# EAGLE design sd-card reader level shift (EAGLE 6.1)
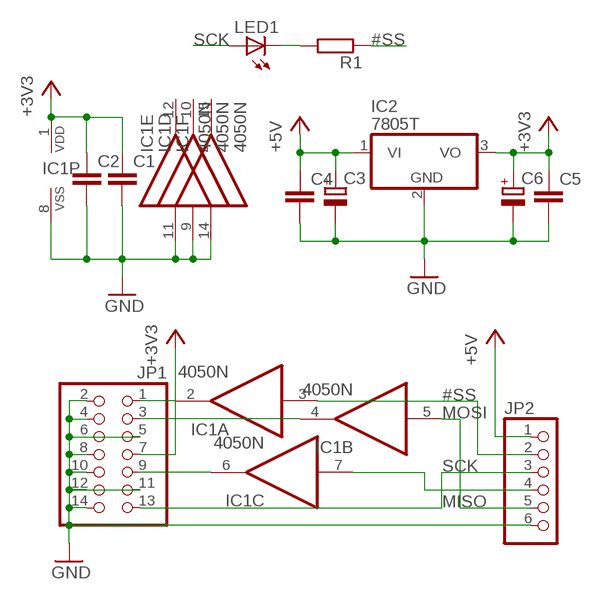
[diagram p0: schematic, sheet 1]

## Parts
C1  C-EU025-025X050  [C025-025X050]
C2  C-EU025-025X050  [C025-025X050]
C3  CPOL-EUE2.5-5  [E2,5-5]
C4  C-EU025-025X050  [C025-025X050]
C5  C-EU025-025X050  [C025-025X050]
C6  CPOL-EUE2.5-5  [E2,5-5]
IC1  4050N  [DIL16]
IC2  7805T  [TO220H]
JP1  PINHD-2X7/90  [2X07/90]
JP2  PINHD-1X6  [1X06]
LED1  LED3MM  [LED3MM]
R1  R-EU_0204/7  [0204/7]

## Nets
#SS: IC1.3(A:I) JP2.2 R1.1
+3V3: C1.1 C2.1 C5.1 C6.+ IC1.1(P:VDD) IC2.3(VO) JP1.7
+5V: C3.+ C4.1 IC2.1(VI) JP2.1
GND: C1.2 C2.2 C3.- C4.2 C5.2 C6.- IC1.8(P:VSS) IC1.9(D:I) IC1.11(E:I) IC1.14(F:I) IC2.2(GND) JP1.2 JP1.4 JP1.5 JP1.6 JP1.8 JP1.10 JP1.11 JP1.12 JP1.14 JP2.6
MISO: JP1.13 JP2.3
MOSI: IC1.5(B:I) JP2.5
N$2: IC1.2(A:O) JP1.1
N$3: IC1.4(B:O) JP1.3
N$4: IC1.6(C:O) JP1.9
N$6: LED1.K(C) R1.2
SCK: IC1.7(C:I) JP2.4 LED1.A
Unconnected: IC1.10(D:O) IC1.12(E:O) IC1.15(F:O)

## Library data of the parts
C1 C2 C4 C5 = rcl:C-EU: CAPACITOR, European symbol
C3 C6 = rcl:CPOL-EU: POLARIZED CAPACITOR, European symbol
IC1 = 40xx:4050: Hex non-inverting BUFFER
IC2 = adafruit:78*: Positive VOLTAGE REGULATOR Added bigger pads to the TO-92 package
JP1 = pinhead:PINHD-2X7: PIN HEADER
JP2 = pinhead:PINHD-1X6: PIN HEADER
LED1 = led:LED: LED OSRAM: - CHIPLED LG R971, LG N971, LY N971, LG Q971, LY Q971, LO R971, LY R971 LH N974, LH R974 LS Q976, LO Q976, LY Q976 LO Q996 - Hyper CHIPLED LW Q18S LB Q993, LB Q99A, LB R99A - SideLED LS A670, LO A670, LY A670, LG A670, LP A670 LB A673, LV A673, LT A673, LW A673 LH A674 LY A675 LS A676, LA A676, LO A676, LY A676, LW A676 LS A679, LY A679, LG A679 - Hyper Micro SIDELED® LS Y876, LA Y876, LO Y876, LY Y876 LT Y87S - SmartLED LW L88C, LW L88S LB L89C, LB L89S, LG L890 LS L89K, LO L89K, LY L89K LS L896, LA L896, LO L896, LY L896 - TOPLED LS T670, LO T670, LY T670, LG T670, LP T670 LSG T670, LSP T670, LSY T670, LOP T670, LYG T670 LG T671, LOG T671, LSG T671 LB T673, LV T673, LT T673, LW T673 LH T674 LS T676, LA T676, LO T676, LY T676, LB T676, LH T676, LSB T676, LW T676 LB T67C, LV T67C, LT T67C, LS T67K, LO T67K, LY T67K, LW E67C LS E67B, LA E67B, LO E67B, LY E67B, LB E67C, LV E67C, LT E67C LW T67C LS T679, LY T679, LG T679 LS T770, LO T770, LY T770, LG T770, LP T770 LB T773, LV T773, LT T773, LW T773 LH T774 LS E675, LA E675, LY E675, LS T675 LS T776, LA T776, LO T776, LY T776, LB T776 LHGB T686 LT T68C, LB T68C - Hyper Mini TOPLED® LB M676 - Mini TOPLED Santana® LG M470 LS M47K, LO M47K, LY M47K Source: http://www.osram.convergy.de LUXEON: - LUMILED® LXK2-PW12-R00, LXK2-PW12-S00, LXK2-PW14-U00, LXK2-PW14-V00 LXK2-PM12-R00, LXK2-PM12-S00, LXK2-PM14-U00 LXK2-PE12-Q00, LXK2-PE12-R00, LXK2-PE12-S00, LXK2-PE14-T00, LXK2-PE14-U00 LXK2-PB12-K00, LXK2-PB12-L00, LXK2-PB12-M00, LXK2-PB14-N00, LXK2-PB14-P00, LXK2-PB14-Q00 LXK2-PR12-L00, LXK2-PR12-M00, LXK2-PR14-Q00, LXK2-PR14-R00 LXK2-PD12-Q00, LXK2-PD12-R00, LXK2-PD12-S00 LXK2-PH12-R00, LXK2-PH12-S00 LXK2-PL12-P00, LXK2-PL12-Q00, LXK2-PL12-R00 Source: www.luxeon.com KINGBRIGHT: KA-3528ASYC Source: www.kingbright.com
R1 = rcl:R-EU_: RESISTOR, European symbol

## Board
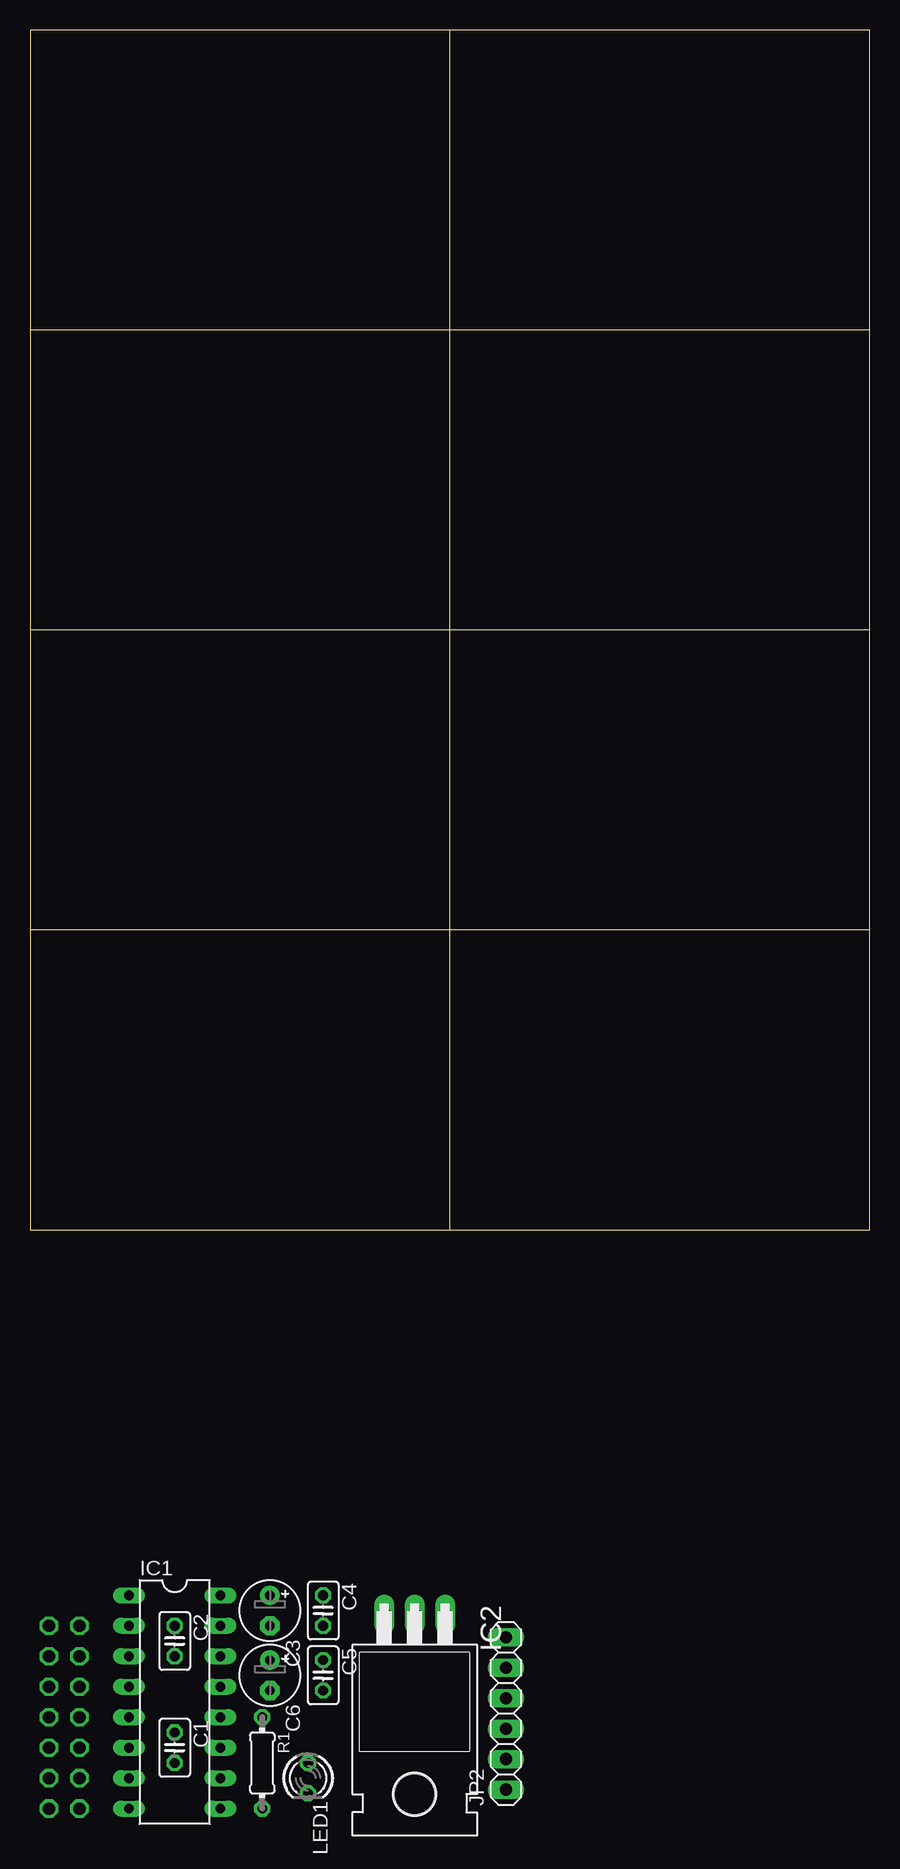
[diagram p1: board, top side]
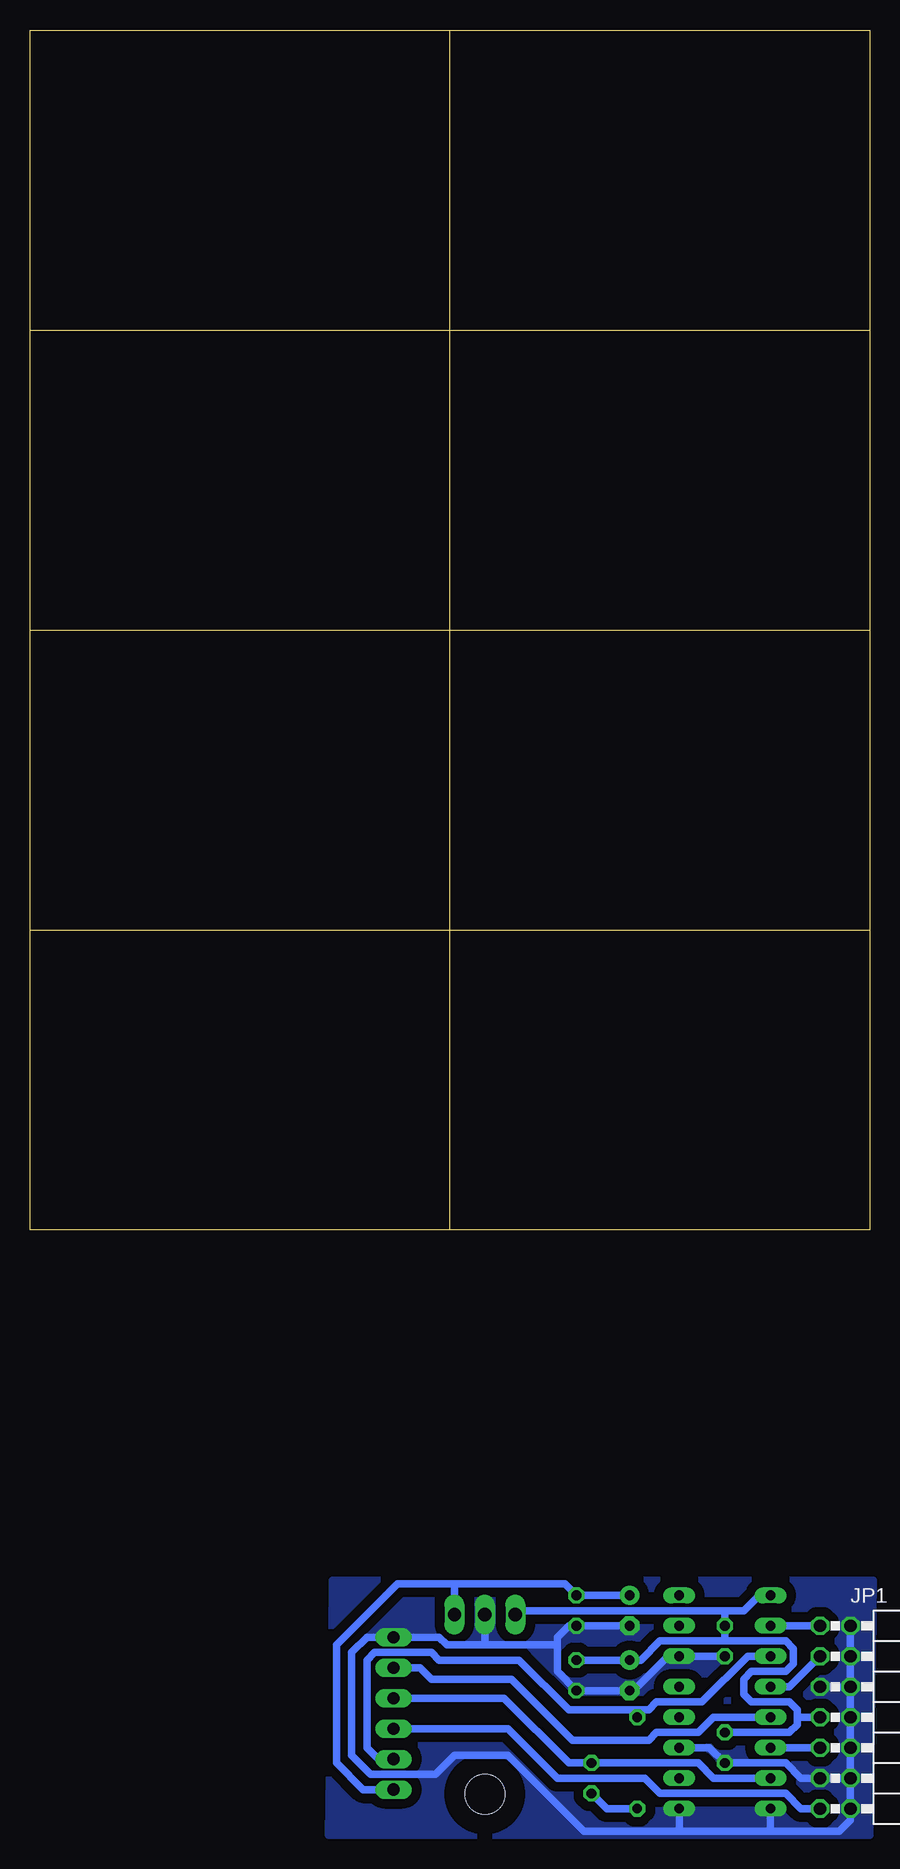
[diagram p2: board, bottom side, seen from below]

Size 70 x 100 mm. Coordinates in mm from the lower left corner, seen from the top.
Outline: 35,0 0,0 0,25
Outline: 35,0 70,0 70,25
Outline: 70,25 70,50
Outline: 70,50 70,75
Outline: 70,75 70,100 35,100
Outline: 35,100 0,100 0,75
Outline: 0,75 0,50
Outline: 0,50 0,25
Outline: 70,25 0,25
Outline: 35,0 35,100
Outline: 70,75 0,75
Outline: 70,50 0,50
Copper layers (1*16): Top 0.035mm / dielectric 1.5mm / Bottom 0.035mm
Design rules: minimum track width 10mil, minimum drill 24mil, track to track 8mil, track to pad 8mil, pad to pad 8mil, via to via 8mil, smd to smd 8mil, copper to edge 40mil, drill to drill 8mil, minimum pad ring 10mil, minimum via ring 8mil, stop-mask expansion 4mil, vias tented up to drill 0mil, thermal gap 10mil

### Footprints (pad centres in the part's own frame; a part is rotated, then mirrored left to right if it is on the bottom)
C025-025X050 = drill 0.813 octagon: 1 -1.27,0; 2 1.27,0
E2,5-5 = drill 0.813 pad 1.6: + -1.27,0 | drill 0.813 pad 1.6 octagon: - 1.27,0
DIL16 = drill 0.813 long: 1 -8.89,-3.81; 2 -6.35,-3.81; 3 -3.81,-3.81; 4 -1.27,-3.81; 5 1.27,-3.81; 6 3.81,-3.81; 7 6.35,-3.81; 8 8.89,-3.81; 9 8.89,3.81; 10 6.35,3.81; 11 3.81,3.81; 12 1.27,3.81; 13 -1.27,3.81; 14 -3.81,3.81; 15 -6.35,3.81; 16 -8.89,3.81
TO220H = drill 1.118 long: 1 -2.54,-10.16; 2 0,-10.16; 3 2.54,-10.16 | hole 3.302: 0,4.826
2X07/90 = drill 1.016 octagon: 1 -7.62,-6.35; 2 -7.62,-3.81; 3 -5.08,-6.35; 4 -5.08,-3.81; 5 -2.54,-6.35; 6 -2.54,-3.81; 7 0,-6.35; 8 0,-3.81; 9 2.54,-6.35; 10 2.54,-3.81; 11 5.08,-6.35; 12 5.08,-3.81; 13 7.62,-6.35; 14 7.62,-3.81
1X06 = drill 1.016 long: 1 -6.35,0; 2 -3.81,0; 3 -1.27,0; 4 1.27,0; 5 3.81,0; 6 6.35,0
LED3MM = drill 0.813 octagon: A -1.27,0; K 1.27,0
0204/7 = drill 0.813 octagon: 1 -3.81,0; 2 3.81,0

### Placement (x,y rotation side)
C1  12.06,-43.18 270 top  (outside the outline)
C2  12.06,-34.29 270 top  (outside the outline)
C3  20,-31.75 270 top  (outside the outline)
C4  24.45,-31.75 270 top  (outside the outline)
C5  24.45,-37.15 270 top  (outside the outline)
C6  20,-37.15 270 top  (outside the outline)
IC1  12.06,-39.37 270 top  (outside the outline)
IC2  32.07,-42.23 180 top  (outside the outline)
JP1  -2.22,-40.64 270 bottom  (outside the outline)
JP2  39.69,-40.32 90 top  (outside the outline)
LED1  23.18,-45.72 270 top  (outside the outline)
R1  19.37,-44.45 270 top  (outside the outline)

### Tracks (layer width: path | path; a pad name or v marks a point on that pad's centre or on a via)
#SS
  Bottom 0.61: IC1.3 10.16,-35.56 13.97,-39.37 17.78,-39.37 18.41,-40.01 19.37,-40.01 | 19.37,-40.01 25.08,-40.01 29.21,-35.88 35.88,-35.88 36.51,-35.24 41.27,-35.24 41.91,-35.88 41.91,-43.18 40.96,-44.13 JP2.2 | R1.1 19.37,-40.01
+3V3
  Bottom 0.61: 12.06,-31.75 10.48,-31.75 9.21,-30.48 IC1.1 | 12.06,-31.75 29.21,-31.75 IC2.3 | C5.1 C6.+ 19.05,-35.88 17.46,-34.29 12.06,-34.29 | 6.03,-40.64 6.03,-40.01 6.67,-39.37 9.84,-39.37 10.48,-38.73 10.48,-37.47 9.84,-36.83 6.99,-36.83 6.35,-36.2 6.35,-34.92 6.99,-34.29 12.06,-34.29 | 6.03,-40.64 6.03,-41.27 6.67,-41.91 C1.1 | JP1.7 6.03,-40.64 | 12.06,-31.75 C2.1 12.06,-34.29
+5V
  Bottom 0.61: C3.+ C4.1 25.4,-29.53 34.61,-29.53 | 34.61,-29.53 39.37,-29.53 44.45,-34.61 44.45,-44.45 42.23,-46.67 JP2.1 | IC2.1 34.61,-29.53
GND
  Bottom 0.61: C3.- C4.2 25.08,-33.02 26.04,-33.97 26.04,-34.61 | JP1.2 JP1.4 JP1.6 | JP1.6 JP1.8 JP1.10 JP1.12 | JP1.12 JP1.14 | JP1.12 JP1.11 5.71,-45.72 6.99,-44.45 C1.2 13.34,-43.18 IC1.11 | JP1.5 JP1.6 | JP1.6 JP1.14 | JP1.14 1.59,-49.21 2.54,-50.16 8.26,-50.16 | 8.26,-50.16 15.88,-50.16 | C2.2 IC1.14 16.83,-35.56 19.68,-38.42 C6.- C5.2 26.04,-36.83 26.04,-34.61 | IC1.8 8.26,-50.16 | IC2.2 32.07,-34.61 | IC1.9 15.88,-50.16 | 32.07,-34.61 35.24,-34.61 35.88,-33.97 JP2.6 41.91,-33.97 43.18,-35.24 43.18,-43.81 41.59,-45.4 36.2,-45.4 34.61,-43.81 30.16,-43.81 23.81,-50.16 15.88,-50.16 | 32.07,-34.61 26.04,-34.61
  pour Bottom (isolate 0.813, no thermals): 45.09,-50.48 44.77,-30.16 44.77,-29.21 -0.32,-29.21 0,-50.48
MISO
  Bottom 0.61: JP1.13 5.71,-48.26 6.99,-46.99 17.46,-46.99 18.73,-45.72 26.04,-45.72 30.16,-41.59 JP2.3
MOSI
  Bottom 0.61: JP2.5 37.47,-36.51 36.51,-37.47 29.84,-37.47 24.77,-42.55 18.41,-42.55 17.78,-41.91 14.29,-41.91 13.02,-40.64 IC1.5
N$2
  Bottom 0.61: JP1.1 IC1.2
N$3
  Bottom 0.61: IC1.4 6.67,-38.1 JP1.3
N$4
  Bottom 0.61: JP1.9 IC1.6
N$6
  Bottom 0.61: R1.2 21.91,-48.26 LED1.K
SCK
  Bottom 0.61: IC1.7 13.02,-45.72 14.29,-44.45 LED1.A 25.08,-44.45 30.48,-39.05 JP2.4